# Altium project Test_Board.PrjPcb
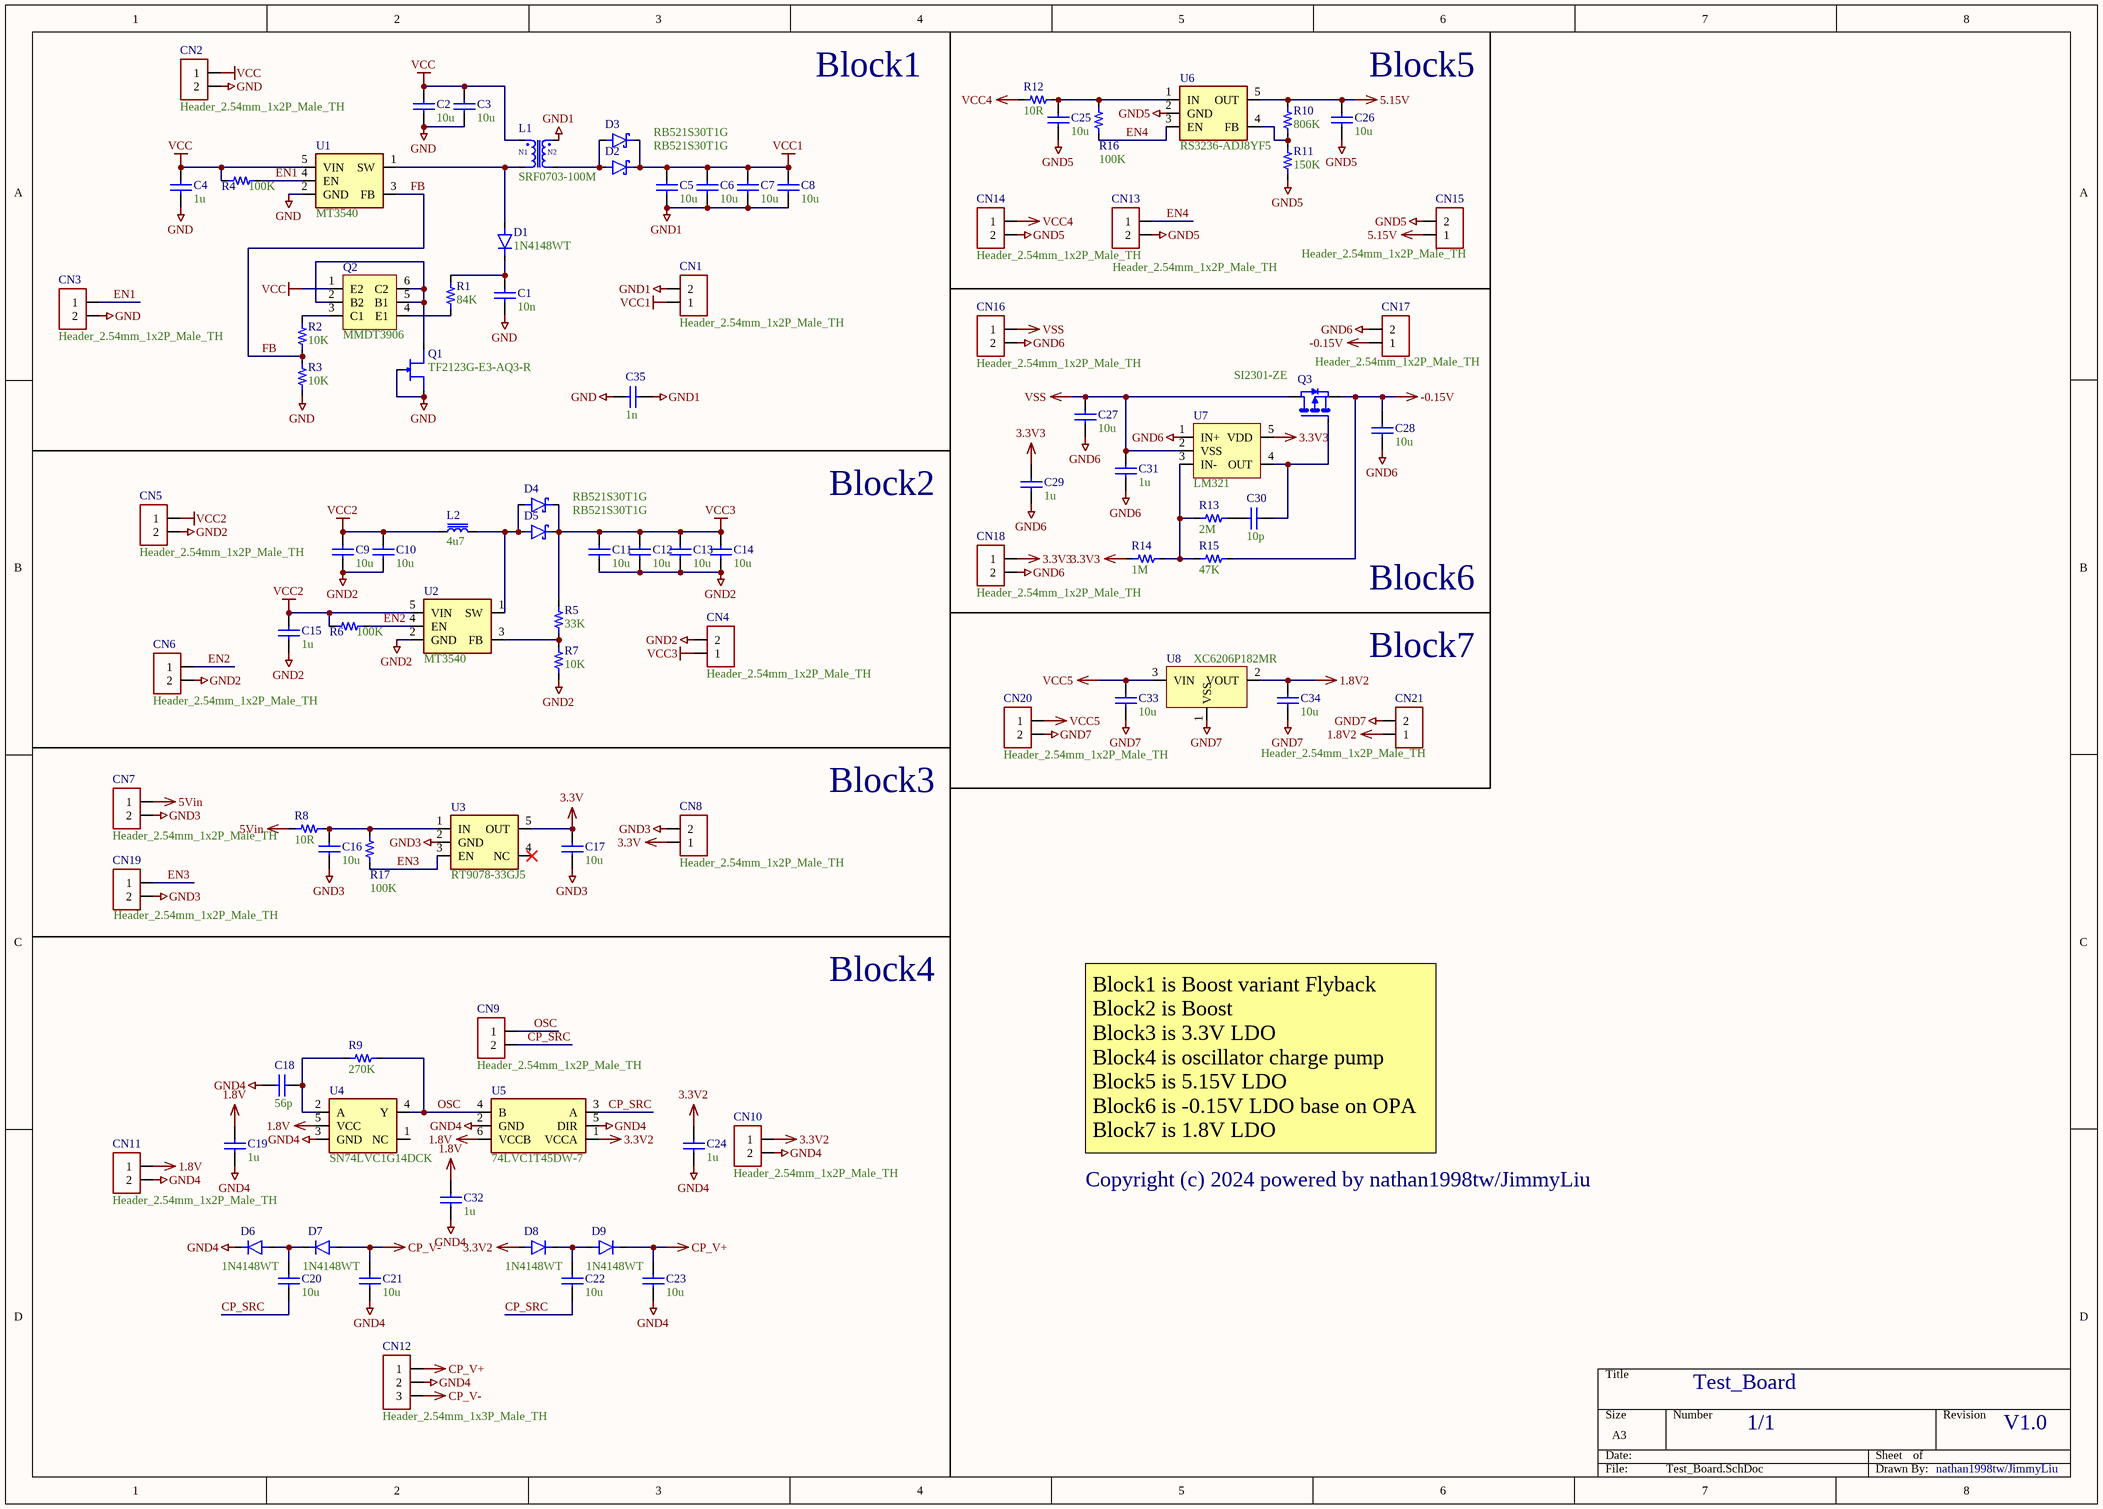
[diagram p0: Test_Board.SchDoc]
1 sheet, 95 parts. Net scope: global (net labels, ports and power ports of the same name join across sheets).
Board file: Test_Board.PcbDoc

## Sheet Test_Board.SchDoc
size A3; SheetNumber: 1; SheetTotal: 1

### Parts
C1  10n  [CAP_0402]
C2  10u  [CAP_0603]
C3  10u  [CAP_0603]
C4  1u  [CAP_0402]
C5  10u  [CAP_0603]
C6  10u  [CAP_0603]
C7  10u  [CAP_0603]
C8  10u  [CAP_0603]
C9  10u  [CAP_0603]
C10  10u  [CAP_0603]
C11  10u  [CAP_0603]
C12  10u  [CAP_0603]
C13  10u  [CAP_0603]
C14  10u  [CAP_0603]
C15  1u  [CAP_0402]
C16  10u  [CAP_0603]
C17  10u  [CAP_0603]
C18  56p  [CAP_0402]
C19  1u  [CAP_0402]
C20  10u  [CAP_0402]
C21  10u  [CAP_0402]
C22  10u  [CAP_0402]
C23  10u  [CAP_0402]
C24  1u  [CAP_0402]
C25  10u  [CAP_0603]
C26  10u  [CAP_0603]
C27  10u  [CAP_0603]
C28  10u  [CAP_0402]
C29  1u  [CAP_0402]
C30  10p  [CAP_0402]
C31  1u  [CAP_0402]
C32  1u  [CAP_0402]
C33  10u  [CAP_0603]
C34  10u  [CAP_0603]
C35  1n  [CAP_0402]
CN1  Header_2.54mm_1x2P_Male_TH  [Header_2.54mm_1x2P_Male_TH]
CN2  Header_2.54mm_1x2P_Male_TH  [Header_2.54mm_1x2P_Male_TH]
CN3  Header_2.54mm_1x2P_Male_TH  [Header_2.54mm_1x2P_Male_TH]
CN4  Header_2.54mm_1x2P_Male_TH  [Header_2.54mm_1x2P_Male_TH]
CN5  Header_2.54mm_1x2P_Male_TH  [Header_2.54mm_1x2P_Male_TH]
CN6  Header_2.54mm_1x2P_Male_TH  [Header_2.54mm_1x2P_Male_TH]
CN7  Header_2.54mm_1x2P_Male_TH  [Header_2.54mm_1x2P_Male_TH]
CN8  Header_2.54mm_1x2P_Male_TH  [Header_2.54mm_1x2P_Male_TH]
CN9  Header_2.54mm_1x2P_Male_TH  [Header_2.54mm_1x2P_Male_TH]
CN10  Header_2.54mm_1x2P_Male_TH  [Header_2.54mm_1x2P_Male_TH]
CN11  Header_2.54mm_1x2P_Male_TH  [Header_2.54mm_1x2P_Male_TH]
CN12  Header_2.54mm_1x3P_Male_TH  [Header_2.54mm_1x3P_Male_TH]
CN13  Header_2.54mm_1x2P_Male_TH  [Header_2.54mm_1x2P_Male_TH]
CN14  Header_2.54mm_1x2P_Male_TH  [Header_2.54mm_1x2P_Male_TH]
CN15  Header_2.54mm_1x2P_Male_TH  [Header_2.54mm_1x2P_Male_TH]
CN16  Header_2.54mm_1x2P_Male_TH  [Header_2.54mm_1x2P_Male_TH]
CN17  Header_2.54mm_1x2P_Male_TH  [Header_2.54mm_1x2P_Male_TH]
CN18  Header_2.54mm_1x2P_Male_TH  [Header_2.54mm_1x2P_Male_TH]
CN19  Header_2.54mm_1x2P_Male_TH  [Header_2.54mm_1x2P_Male_TH]
CN20  Header_2.54mm_1x2P_Male_TH  [Header_2.54mm_1x2P_Male_TH]
CN21  Header_2.54mm_1x2P_Male_TH  [Header_2.54mm_1x2P_Male_TH]
D1  1N4148WT  [SOD-523-2]
D2  RB521S30T1G  [SOD-523-2]
D3  RB521S30T1G  [SOD-523-2]
D4  RB521S30T1G  [SOD-523-2]
D5  RB521S30T1G  [SOD-523-2]
D6  1N4148WT  [SOD-523-2]
D7  1N4148WT  [SOD-523-2]
D8  1N4148WT  [SOD-523-2]
D9  1N4148WT  [SOD-523-2]
L1  SRF0703-100M  [SRF0703]
L2  4u7  [IND_0806]
Q1  TF2123G-E3-AQ3-R  [SOT-723-3_120X80X50_40P]
Q2  MMDT3906  [SOT-363-6_215X130X110_65P]
Q3  SI2301-ZE  [SOT-23-3_290X130X103_95P]
R1  84K  [RES_0402]
R2  10K  [RES_0402]
R3  10K  [RES_0402]
R4  100K  [RES_0402]
R5  33K  [RES_0402]
R6  100K  [RES_0402]
R7  10K  [RES_0402]
R8  10R  [RES_0402]
R9  270K  [RES_0402]
R10  806K  [RES_0402]
R11  150K  [RES_0402]
R12  10R  [RES_0402]
R13  2M  [RES_0402]
R14  1M  [RES_0402]
R15  47K  [RES_0402]
R16  100K  [RES_0402]
R17  100K  [RES_0402]
U1  MT3540  [SOT-23-5_290X160X120_95P]
U2  MT3540  [SOT-23-5_290X160X120_95P]
U3  RT9078-33GJ5  [SOT-23-5_290X160X120_95P]
U4  SN74LVC1G14DCK  [SOT-353-5_215X130X110_65P]
U5  74LVC1T45DW-7  [SOT-363-6_215X130X110_65P]
U6  RS3236-ADJ8YF5  [SOT-23-5_290X160X120_95P]
U7  LM321  [SOT-23-5_290X160X120_95P]
U8  XC6206P182MR  [SOT-23-3_290X130X95_95P_S]

### Nets
1.8V: C19.1 C32.1 CN11.1 U4.5(VCC) U5.6(VCCB)
1.8V2: C34.1 CN21.1 U8.2(VOUT)
3.3V: C17.1 CN8.1 U3.5(OUT)
3.3V2: C24.1 CN10.1 D8.2(A) U5.1(VCCA)
3.3V3: C29.1 CN18.1 R14.2 U7.5(VDD)
5.15V: C26.1 CN15.1 R10.2 U6.5(OUT)
5Vin: CN7.1 R8.2
-0.15V: C28.1 CN17.1 Q3.2(S) R15.1
CP_V+: C23.1 CN12.1 D9.1(K)
CP_V-: C21.1 CN12.3 D7.2(A)
GND: C1.2 C2.2 C3.2 C4.2 C35.1 CN2.2 CN3.2 Q1.2(S) Q1.3(G) R3.1 U1.2(GND)
GND1: C5.2 C6.2 C7.2 C8.2 C35.2 CN1.2 L1.2
GND2: C9.2 C10.2 C11.2 C12.2 C13.2 C14.2 C15.2 CN4.2 CN5.2 CN6.2 R7.1 U2.2(GND)
GND3: C16.2 C17.2 CN7.2 CN8.2 CN19.2 U3.2(GND)
GND4: C18.2 C19.2 C21.2 C23.2 C24.2 C32.2 CN10.2 CN11.2 CN12.2 D6.1(K) U4.3(GND) U5.2(GND) U5.5(DIR)
GND5: C25.2 C26.2 CN13.2 CN14.2 CN15.2 R11.1 U6.2(GND)
GND6: C27.2 C28.2 C29.2 C31.2 CN16.2 CN17.2 CN18.2 U7.1(IN+)
GND7: C33.2 C34.2 CN20.2 CN21.2 U8.1(VSS)
VCC: C2.1 C3.1 C4.1 CN2.1 L1.1 Q2.1(E2) R4.2 U1.5(VIN)
VCC1: C5.1 C6.1 C7.1 C8.1 CN1.1 D2.1(K) D3.1(K)
VCC2: C9.1 C10.1 C15.1 CN5.1 L2.1 R6.2 U2.5(VIN)
VCC3: C11.1 C12.1 C13.1 C14.1 CN4.1 D4.1(K) D5.1(K) R5.2
VCC4: CN14.1 R12.2
VCC5: C33.1 CN20.1 U8.3(VIN)
VSS: C27.1 C31.1 CN16.1 Q3.3(D) U7.2(VSS)
CP_SRC: C20.2 C22.2 CN9.2 U5.3(A)
EN1: CN3.1 R4.1 U1.4(EN)
EN2: CN6.1 R6.1 U2.4(EN)
EN3: CN19.1 R17.2 U3.3(EN)
EN4: CN13.1 R16.1 U6.3(EN)
FB: R2.1 R3.2 U1.3(FB)
OSC: CN9.1 R9.1 U4.4(Y) U5.4(B)
NetC1_1: C1.1 D1.1(K) R1.2
NetC16_1: C16.1 R8.1 R17.1 U3.1(IN)
NetC18_1: C18.1 R9.2 U4.2(A)
NetC20_1: C20.1 D6.2(A) D7.1(K)
NetC22_1: C22.1 D8.1(K) D9.2(A)
NetC25_1: C25.1 R12.1 R16.2 U6.1(IN)
NetC30_1: C30.1 R13.1
NetC30_2: C30.2 Q3.1(G) U7.4(OUT)
NetD1_2: D1.2(A) L1.3 U1.1(SW)
NetD2_2: D2.2(A) D3.2(A) L1.4
NetD4_2: D4.2(A) D5.2(A) L2.2 U2.1(SW)
NetQ1_1: Q1.1(D) Q2.2(B2) Q2.5(B1) Q2.6(C2)
NetQ2_3: Q2.3(C1) R2.2
NetQ2_4: Q2.4(E1) R1.1
NetR5_1: R5.1 R7.2 U2.3(FB)
NetR10_1: R10.1 R11.2 U6.4(FB)
NetR13_2: R13.2 R14.1 R15.2 U7.3(IN-)

Not connected (* = marked no-connect by the designer): U3 4(NC)*; U4 1(NC)

### Notes on the sheet
- Block1
- (near C26) Block5
- Block2
- Block6
- Block7
- Block3
- Block4
- Copyright (c) 2024 powered by nathan1998tw/JimmyLiu
- Block1 is Boost variant Flyback
  Block2 is Boost
  Block3 is 3.3V LDO
  Block4 is oscillator charge pump
  Block5 is 5.15V LDO
  Block6 is -0.15V LDO base on OPA
  Block7 is 1.8V LDO
- Test_Board
- 1/1
- V1.0
- nathan1998tw/JimmyLiu
- (in symbol SRF0703-100M) N1; N2

### Library data of the parts
C1-C35 = Capacitor: Voltage: V
  C1: Value: 10n
  C2 C3 C5-C14 C16 C17 C20-C23 C25-C28 C33 C34: Value: 10u
  C4 C15 C19 C24 C29 C31 C32: Value: 1u
  C18: Value: 56p
  C30: Value: 10p
  C35: Value: 1n
CN1-CN11 CN13-CN21 = Header_2.54mm_1x2P_Male_TH: Header_2.54mm_1x2P_Male / Through-hole; Value: Header_2.54mm_1x2P_Male_TH
CN12 = Header_2.54mm_1x3P_Male_TH: Header_2.54mm_1x3P_Male / Through-hole; Value: Header_2.54mm_1x3P_Male_TH
D1 D6-D9 = 1N4148WT: Signal Diode; Value: 1N4148WT
D2-D5 = RB521S30T1G: Schottky Diode; Value: RB521S30T1G
L1 = SRF0703-100M: Current: A; Value: SRF0703-100M
L2 = Inductor_IRON: Current: A; Value: 4u7
Q1 = TF2123G-E3-AQ3-R: N-JFET; Value: TF2123G-E3-AQ3-R
Q2 = MMDT3906: Double PNP; Value: MMDT3906
Q3 = SI2301-ZE: P-MOSFET; Value: SI2301-ZE
R1-R17 = Resistor: Voltage: V
  R1: Value: 84K
  R2 R3 R7: Value: 10K
  R4 R6 R16 R17: Value: 100K
  R5: Value: 33K
  R8 R12: Value: 10R
  R9: Value: 270K
  R10: Value: 806K
  R11: Value: 150K
  R13: Value: 2M
  R14: Value: 1M
  R15: Value: 47K
U1 U2 = MT3540: Asynchronous Boost Convertor / Vin:2.5~5.5V / Vout:Vin~28V; Value: MT3540
U3 = RT9078-33GJ5: LDO 3.3V; Value: RT9078-33GJ5
U4 = SN74LVC1G14DCK: Schmitt trigger inverter; Value: SN74LVC1G14DCK
U5 = 74LVC1T45DW-7: 1-bit Voltage Translator; Value: 74LVC1T45DW-7
U6 = RS3236-ADJ8YF5: LDO Adjustable; Value: RS3236-ADJ8YF5
U7 = LM321: Single_OPA; Value: LM321
U8 = XC6206P182MR: LDO 1.8V; Value: XC6206P182MR